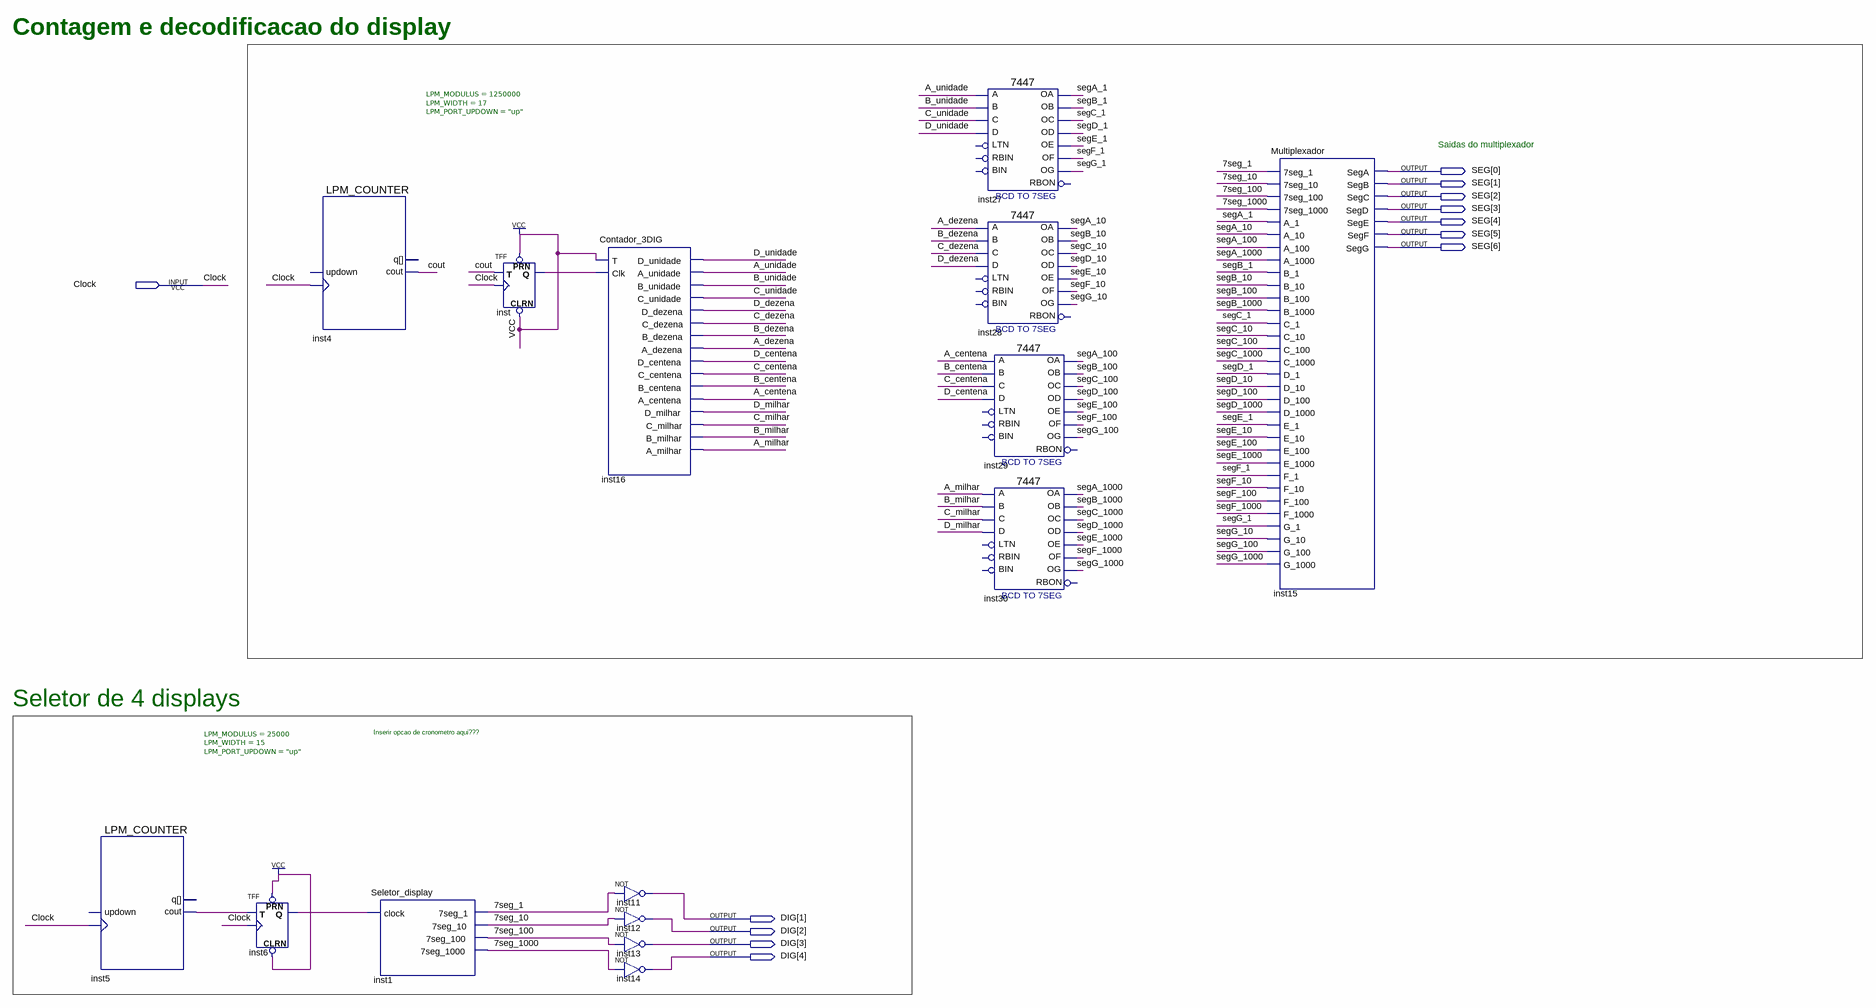
[diagram p0: schematic sheet]
// Quartus schematic ED_aula1.bdf as structural Verilog: 15 symbols, 12 pins
module ED_aula1 (
  input  Clock,
  output [6:0] SEG,
  output [4:1] DIG
);

  wire \7seg_1 , \7seg_10 , \7seg_100 , \7seg_1000 , A_centena, A_dezena, A_milhar, A_unidade, B_centena,
       B_dezena, B_milhar, B_unidade, C_centena, C_dezena, C_milhar, C_unidade, cout, D_centena, D_dezena,
       D_milhar, D_unidade, inst5_cout, inst6_q, inst_q, segA_1, segA_10, segA_100, segA_1000, segB_1,
       segB_10, segB_100, segB_1000, segC_1, segC_10, segC_100, segC_1000, segD_1, segD_10, segD_100,
       segD_1000, segE_1, segE_10, segE_100, segE_1000, segF_1, segF_10, segF_100, segF_1000, segG_1,
       segG_10, segG_100, segG_1000;

  LPM_COUNTER #(.LPM_MODULUS(25000), .LPM_WIDTH(15), .LPM_PORT_UPDOWN("up")) inst5 (
    .clock(Clock), .cout(inst5_cout));  // open: updown, q
  TFF inst6 (.PRN(1'b1), .CLRN(1'b1), .T(inst5_cout), .CLK(Clock), .Q(inst6_q));
  LPM_COUNTER #(.LPM_MODULUS(1250000), .LPM_WIDTH(17), .LPM_PORT_UPDOWN("up")) inst4 (
    .clock(Clock), .cout(cout));  // open: updown, q
  Seletor_display inst1 (
    .clock(inst6_q), .\7seg_1 (\7seg_1 ), .\7seg_10 (\7seg_10 ), .\7seg_100 (\7seg_100 ),
    .\7seg_1000 (\7seg_1000 ));
  TFF inst (.PRN(1'b1), .CLRN(1'b1), .T(cout), .CLK(Clock), .Q(inst_q));
  Contador_3DIG inst16 (
    .T(1'b1), .Clk(inst_q), .D_unidade(D_unidade), .A_unidade(A_unidade), .B_unidade(B_unidade),
    .C_unidade(C_unidade), .D_dezena(D_dezena), .C_dezena(C_dezena), .B_dezena(B_dezena),
    .A_dezena(A_dezena), .D_centena(D_centena), .C_centena(C_centena), .B_centena(B_centena),
    .A_centena(A_centena), .D_milhar(D_milhar), .C_milhar(C_milhar), .B_milhar(B_milhar), .A_milhar(A_milhar));
  not inst11 (DIG[1], \7seg_1 );
  not inst12 (DIG[2], \7seg_10 );
  not inst13 (DIG[3], \7seg_100 );
  not inst14 (DIG[4], \7seg_1000 );
  \7447  inst27 (
    .B(B_unidade), .C(C_unidade), .D(D_unidade), .A(A_unidade), .OB(segB_1), .OC(segC_1), .OE(segE_1),
    .OD(segD_1), .OF(segF_1), .OG(segG_1), .OA(segA_1));  // open: LTN, RBIN, BIN, RBON
  \7447  inst28 (
    .B(B_dezena), .C(C_dezena), .D(D_dezena), .A(A_dezena), .OB(segB_10), .OC(segC_10), .OE(segE_10),
    .OD(segD_10), .OF(segF_10), .OG(segG_10), .OA(segA_10));  // open: LTN, RBIN, BIN, RBON
  \7447  inst29 (
    .B(B_centena), .C(C_centena), .D(D_centena), .A(A_centena), .OB(segB_100), .OC(segC_100), .OE(segE_100),
    .OD(segD_100), .OF(segF_100), .OG(segG_100), .OA(segA_100));  // open: LTN, RBIN, BIN, RBON
  \7447  inst30 (
    .B(B_milhar), .C(C_milhar), .D(D_milhar), .A(A_milhar), .OB(segB_1000), .OC(segC_1000), .OE(segE_1000),
    .OD(segD_1000), .OF(segF_1000), .OG(segG_1000), .OA(segA_1000));  // open: LTN, RBIN, BIN, RBON
  Multiplexador inst15 (
    .\7seg_1 (\7seg_1 ), .\7seg_10 (\7seg_10 ), .\7seg_100 (\7seg_100 ), .\7seg_1000 (\7seg_1000 ),
    .A_1(segA_1), .A_10(segA_10), .A_100(segA_100), .A_1000(segA_1000), .B_1(segB_1), .B_10(segB_10),
    .B_100(segB_100), .B_1000(segB_1000), .C_1(segC_1), .C_10(segC_10), .C_100(segC_100), .C_1000(segC_1000),
    .D_1(segD_1), .D_10(segD_10), .D_100(segD_100), .D_1000(segD_1000), .E_1(segE_1), .E_10(segE_10),
    .E_100(segE_100), .E_1000(segE_1000), .F_1(segF_1), .F_10(segF_10), .F_100(segF_100), .F_1000(segF_1000),
    .G_1(segG_1), .G_10(segG_10), .G_100(segG_100), .G_1000(segG_1000), .SegA(SEG[0]), .SegB(SEG[1]),
    .SegC(SEG[2]), .SegD(SEG[3]), .SegE(SEG[4]), .SegF(SEG[5]), .SegG(SEG[6]));

  // Notes on the sheet:
  //   Contagem e decodificacao do display
  //   Saidas do multiplexador
  //   Seletor de 4 displays
  //   Inserir opcao de cronometro aqui???
endmodule
